# Altium project Docking Station.PrjPcb
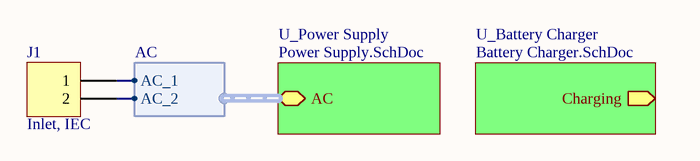
[diagram p0: Docking Station.SchDoc]
3 sheets, 44 parts. Net scope: hierarchical (ports join the sheet entries above them; power ports are global).
Board file: Docking Station.PcbDoc
Sheets:
  Docking Station.SchDoc
    U_Power Supply = Power Supply.SchDoc
    U_Battery Charger = Battery Charger.SchDoc

## Sheet Docking Station.SchDoc
size A4

### Parts
J1  Inlet, IEC  [Inlet, IEC - Plug]

### Sub-sheets
U_Battery Charger = Battery Charger.SchDoc: Charging (out)
U_Power Supply = Power Supply.SchDoc: AC (harness AC)

### Harnesses
AC: AC_1, AC_2

### Nets
AC_1: J1.1 ; sheet U_Power Supply/AC.AC_1
AC_2: J1.2 ; sheet U_Power Supply/AC.AC_2

### Library data of the parts
J1 = Inlet, IEC - Plug

## Sheet Power Supply.SchDoc
size A4
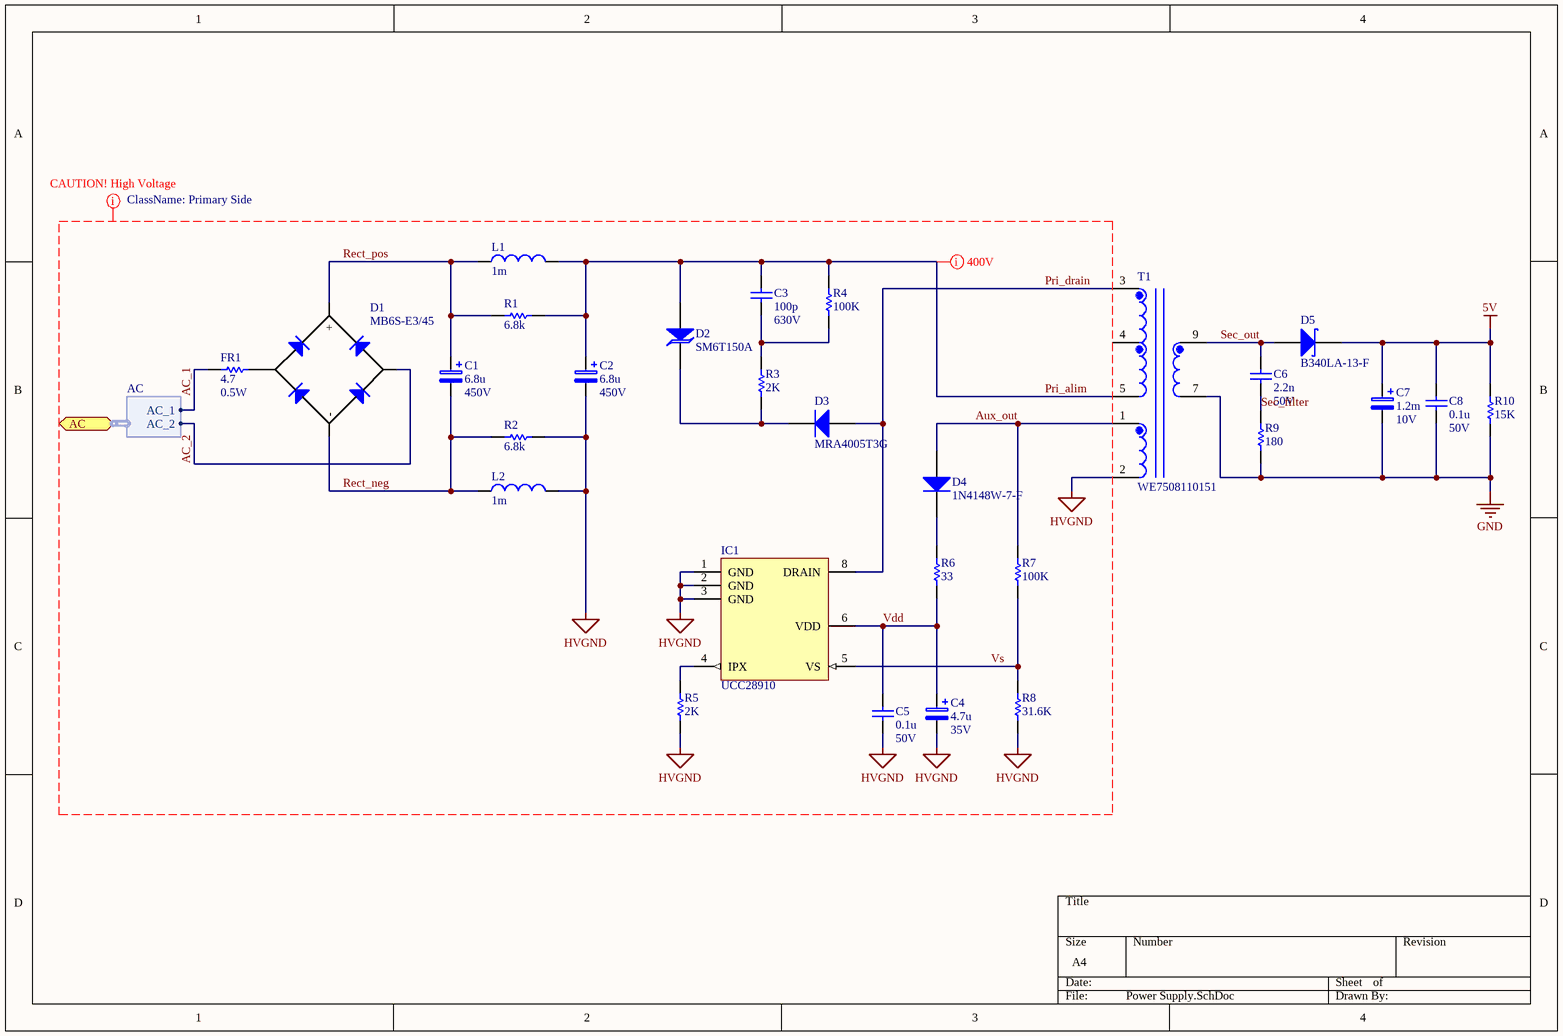
[diagram p1: Power Supply.SchDoc]

### Parts
C1  6.8u  Rated Voltage: 450V  [CRADIAL-5mm-16mm]
C2  6.8u  Rated Voltage: 450V  [CRADIAL-5mm-16mm]
C3  100p  Rated Voltage: 630V  [C1206]
C4  4.7u  Rated Voltage: 35V  [CAPAE5543X54N]
C5  0.1u  Rated Voltage: 50V  [C1206]
C6  2.2n  Rated Voltage: 50V  [C1206]
C7  1.2m  Rated Voltage: 10V  [CRADIAL-5mm-20mm]
C8  0.1u  Rated Voltage: 50V  [C1206]
D1  MB6S-E3/45  [SOP250P670X290-4N]
D2  SM6T150A  [SMB]
D3  MRA4005T3G  [SMA]
D4  1N4148W-7-F  [SOD123]
D5  B340LA-13-F  [SMA]
FR1  4.7  Power: 0.5W  [RAXIAL-10mm-0.8mm]
IC1  UCC28910  [SOIC127P600X175-7N]
L1  1m  [INDUCTOR-5MM]
L2  1m  [INDUCTOR-5MM]
R1  6.8k  [R1206]
R2  6.8k  [R1206]
R3  2K  [R1206]
R4  100K  [R1206]
R5  2K  [R1206]
R6  33  [R1206]
R7  100K  [R1206]
R8  31.6K  [R1206]
R9  180  [R1206]
R10  15K  [R1206]
T1  WE7508110151  [WE7508110151]

### Ports
AC (harness AC)

### Harnesses
AC: AC_1, AC_2

### Nets
5V: C7.1 C8.2 D5.2(K) R10.2
GND: C7.2 C8.1 R9.1 R10.1 T1.7(Sec2)
HVGND: C2.2 C4.2 C5.1 IC1.1(GND) IC1.2(GND) IC1.3(GND) L2.2 R2.2 R5.1 R8.1 T1.2(Aux2)
AC_1: FR1.1 ; port AC.AC_1
AC_2: D1.2(AC) ; port AC.AC_2
Aux_out: D4.1(A) R7.2 T1.1(Aux1)
Pri_alim: C2.1 C3.2 D2.1(A) L1.2 R1.2 R4.2 T1.5(Pri3)
Pri_drain: D3.1(A) IC1.8(DRAIN) T1.3(Pri1)
Rect_neg: C1.2 D1.4(-) L2.1 R2.1
Rect_pos: C1.1 D1.3(+) L1.1 R1.1
Sec_filter: C6.1 R9.2
Sec_out: C6.2 D5.1(A) T1.9(Sec1)
Vdd: C4.1 C5.2 IC1.6(VDD) R6.1
Vs: IC1.5(VS) R7.1 R8.2
NetC3_1: C3.1 R3.2 R4.1
NetD1_1: D1.1(AC) FR1.2
NetD2_2: D2.2(K) D3.2(K) R3.1
NetD4_2: D4.2(K) R6.2
NetIC1_4: IC1.4(IPX) R5.2

Not connected (* = marked no-connect by the designer): T1 4(Pri2)

### Layout directives
net class Primary Side: AC_1, AC_2, Aux_out, HVGND, Pri_alim, Pri_drain, Rect_neg, Rect_pos, Vdd, Vs
mark named 400V: Pri_alim

### Library data of the parts
C1 C2 C4 C7 = Pol Capacitor: Polarized Capacitor
  C1 C2: Value: 6.8u
  C4: Value: 4.7u
  C7: Value: 1.2m
C3 C5 C6 C8 = Capacitor
  C3: Value: 100p
  C5 C8: Value: 0.1u
  C6: Value: 2.2n
D1 = MB6S-E3/45: Diode, Bridge Rectifier
D2 = SM6T150A: Diode, Transient Voltage Suppresor, 150V, 600W
D3 = MRA4005T3G: Diode, Standard, 1A
D4 = 1N4148W-7-F: Diode, Switch, 300mA, 100V
D5 = B340LA-13-F: Diode, Schottky, 40V, 3A
FR1 = Fuse Resistor: Resistor, Fuse; Value: 4.7
IC1 = UCC28910: 700V Flyback Switcher with Constant-Voltage Constant-Current and Primary-side Control
L1 L2 = Inductor: Saturation current: 500mA; Value: 1m
R1-R10 = Resistor: Power: *
  R1 R2: Value: 6.8k
  R3 R5: Value: 2K
  R4 R7: Value: 100K
  R6: Value: 33
  R8: Value: 31.6K
  R9: Value: 180
  R10: Value: 15K
T1 = WE7508110151: Transformer, Flyback

## Sheet Battery Charger.SchDoc
size A4
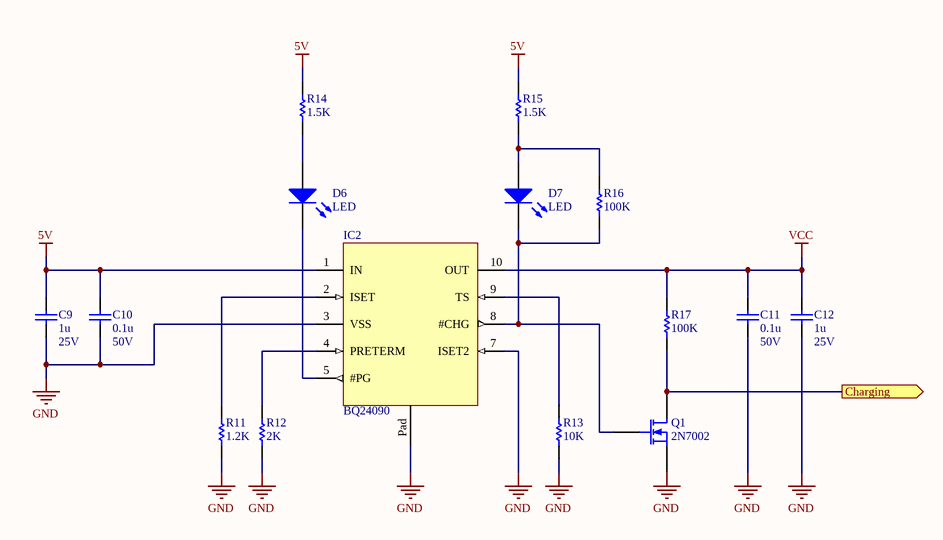
[diagram p2: Battery Charger.SchDoc]

### Parts
C9  1u  Rated Voltage: 25V  [C1206]
C10  0.1u  Rated Voltage: 50V  [C1206]
C11  0.1u  Rated Voltage: 50V  [C1206]
C12  1u  Rated Voltage: 25V  [C1206]
D6  LED  [LED3015M]
D7  LED  [LED3015M]
IC2  BQ24090  [TSSOP50P490X110_HS-11N]
Q1  2N7002  [SOT65P210X110-3N]
R11  1.2K  [R1206]
R12  2K  [R1206]
R13  10K  [R1206]
R14  1.5K  [R1206]
R15  1.5K  [R1206]
R16  100K  [R1206]
R17  100K  [R1206]

### Ports
Charging (out)

### Nets
5V: C9.2 C10.2 IC2.1(IN) R14.2 R15.2
GND: C9.1 C10.1 C11.1 C12.1 IC2.3(VSS) IC2.7(ISET2) IC2.Pad(Thermal) Q1.2(S) R11.1 R12.1 R13.1
VCC: C11.2 C12.2 IC2.10(OUT) R17.2
NetD6_1: D6.1(A) R14.1
NetD6_2: D6.2(K) IC2.5(#PG)
NetD7_1: D7.1(A) R15.1 R16.2
NetD7_2: D7.2(K) IC2.8(#CHG) Q1.1(G) R16.1
NetIC2_2: IC2.2(ISET) R11.2
NetIC2_4: IC2.4(PRETERM) R12.2
NetIC2_9: IC2.9(TS) R13.2
NetQ1_3: Q1.3(D) R17.1 ; port Charging

### Library data of the parts
C9-C12 = Capacitor
  C9 C12: Value: 1u
  C10 C11: Value: 0.1u
IC2 = BQ24090: Battery Charger, Single Cell Li-Ion/LiPo, 1A
Q1 = 2N7002: Transistor, MOSFET, N-Channel, 60V, 300mA
R11-R17 = Resistor: Power: *
  R11: Value: 1.2K
  R12: Value: 2K
  R13: Value: 10K
  R14 R15: Value: 1.5K
  R16 R17: Value: 100K

## Nets that join several sheets
5V: Power Supply (C7.1 C8.2 D5.2 R10.2), Battery Charger (5 pins)
GND: Power Supply (5 pins), Battery Charger (11 pins)
AC_1: Docking Station (J1.1), Power Supply (FR1.1)
AC_2: Docking Station (J1.2), Power Supply (D1.2)